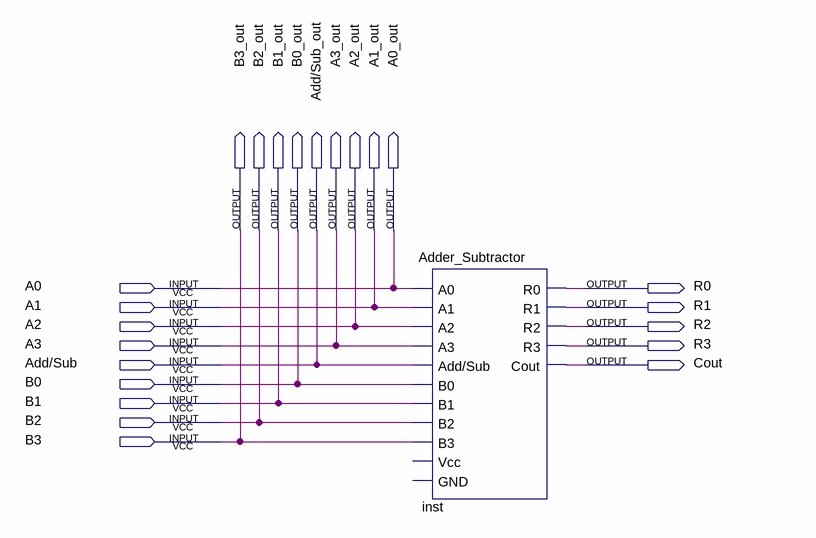
[diagram p0: schematic sheet]
// Quartus schematic Section_3.bdf as structural Verilog: 1 symbols, 23 pins
module Section_3 (
  input  A0,
  input  A1,
  input  A2,
  input  A3,
  input  \Add/Sub ,
  input  B0,
  input  B1,
  input  B2,
  input  B3,
  output B3_out,
  output B2_out,
  output B1_out,
  output B0_out,
  output \Add/Sub_out ,
  output A3_out,
  output A2_out,
  output A1_out,
  output A0_out,
  output R0,
  output R1,
  output R2,
  output R3,
  output Cout
);

  Adder_Subtractor inst (
    .A0(A0), .A1(A1), .A2(A2), .A3(A3), .\Add/Sub (\Add/Sub ), .B0(B0), .B1(B1), .B2(B2), .B3(B3), .R0(R0),
    .R1(R1), .R2(R2), .R3(R3), .Cout(Cout));  // open: Vcc, GND

  assign A0_out = A0;
  assign A1_out = A1;
  assign A2_out = A2;
  assign A3_out = A3;
  assign \Add/Sub_out  = \Add/Sub ;
  assign B0_out = B0;
  assign B1_out = B1;
  assign B2_out = B2;
  assign B3_out = B3;
endmodule
